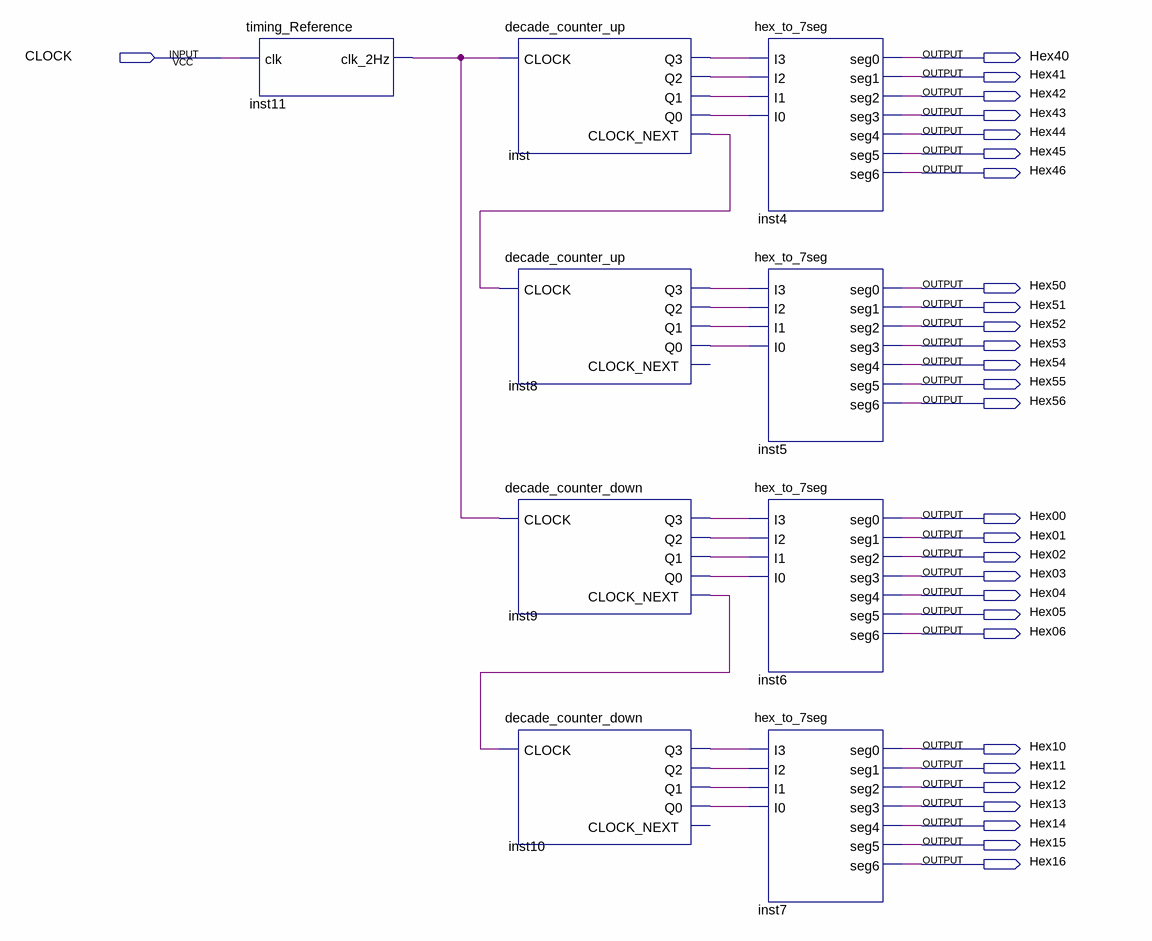
[diagram p0: schematic sheet]
// Quartus schematic lab002_1.bdf as structural Verilog: 9 symbols, 29 pins
module lab002_1 (
  input  CLOCK,
  output Hex40,
  output Hex41,
  output Hex42,
  output Hex43,
  output Hex44,
  output Hex45,
  output Hex46,
  output Hex50,
  output Hex51,
  output Hex52,
  output Hex53,
  output Hex54,
  output Hex55,
  output Hex56,
  output Hex00,
  output Hex01,
  output Hex02,
  output Hex03,
  output Hex04,
  output Hex05,
  output Hex06,
  output Hex10,
  output Hex11,
  output Hex12,
  output Hex13,
  output Hex14,
  output Hex15,
  output Hex16
);

  wire inst8_q0, inst8_q1, inst8_q2, inst8_q3, inst9_clock_next, inst9_q0, inst9_q1, inst9_q2, inst9_q3,
       inst10_q0, inst10_q1, inst10_q2, inst10_q3, inst11_clk_2hz, inst_clock_next, inst_q0, inst_q1,
       inst_q2, inst_q3;

  timing_Reference inst11 (.clk(CLOCK), .clk_2Hz(inst11_clk_2hz));
  decade_counter_up inst (
    .CLOCK(inst11_clk_2hz), .Q3(inst_q3), .Q2(inst_q2), .Q1(inst_q1), .Q0(inst_q0),
    .CLOCK_NEXT(inst_clock_next));
  decade_counter_up inst8 (
    .CLOCK(inst_clock_next), .Q3(inst8_q3), .Q2(inst8_q2), .Q1(inst8_q1), .Q0(inst8_q0));  // open: CLOCK_NEXT
  decade_counter_down inst9 (
    .CLOCK(inst11_clk_2hz), .Q3(inst9_q3), .Q2(inst9_q2), .Q1(inst9_q1), .Q0(inst9_q0),
    .CLOCK_NEXT(inst9_clock_next));
  decade_counter_down inst10 (
    .CLOCK(inst9_clock_next), .Q3(inst10_q3), .Q2(inst10_q2), .Q1(inst10_q1), .Q0(inst10_q0));  // open: CLOCK_NEXT
  hex_to_7seg inst4 (
    .I3(inst_q3), .I2(inst_q2), .I1(inst_q1), .I0(inst_q0), .seg0(Hex40), .seg1(Hex41), .seg2(Hex42),
    .seg3(Hex43), .seg4(Hex44), .seg5(Hex45), .seg6(Hex46));
  hex_to_7seg inst5 (
    .I3(inst8_q3), .I2(inst8_q2), .I1(inst8_q1), .I0(inst8_q0), .seg0(Hex50), .seg1(Hex51), .seg2(Hex52),
    .seg3(Hex53), .seg4(Hex54), .seg5(Hex55), .seg6(Hex56));
  hex_to_7seg inst6 (
    .I3(inst9_q3), .I2(inst9_q2), .I1(inst9_q1), .I0(inst9_q0), .seg0(Hex00), .seg1(Hex01), .seg2(Hex02),
    .seg3(Hex03), .seg4(Hex04), .seg5(Hex05), .seg6(Hex06));
  hex_to_7seg inst7 (
    .I3(inst10_q3), .I2(inst10_q2), .I1(inst10_q1), .I0(inst10_q0), .seg0(Hex10), .seg1(Hex11), .seg2(Hex12),
    .seg3(Hex13), .seg4(Hex14), .seg5(Hex15), .seg6(Hex16));
endmodule
